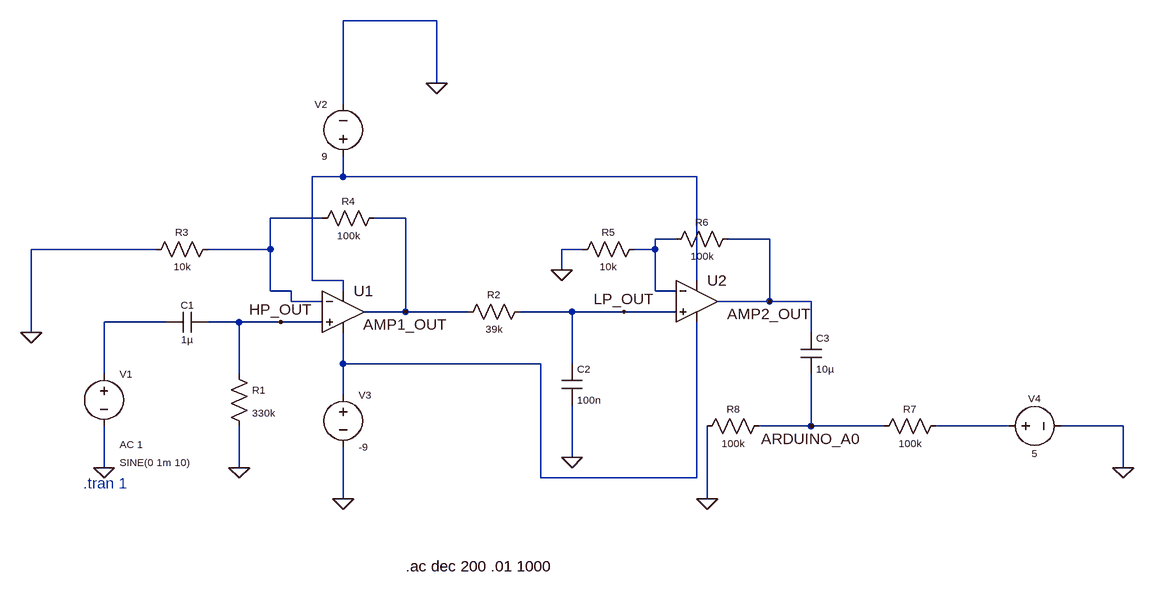
[diagram p0: schematic eeg_frontend_v1_ac_analysis.asc]
eeg_frontend_v1_ac_analysis.asc, the LTspice schematic file:
Version 4.1
SHEET 1 880 680
WIRE -3648 -512 -3792 -512
WIRE -3648 -416 -3648 -512
WIRE -3792 -384 -3792 -512
WIRE -3792 -272 -3792 -304
WIRE -3792 -272 -3840 -272
WIRE -3248 -272 -3792 -272
WIRE -3824 -208 -3904 -208
WIRE -3696 -208 -3744 -208
WIRE -3280 -176 -3312 -176
WIRE -3136 -176 -3200 -176
WIRE -4080 -160 -4272 -160
WIRE -3904 -160 -3904 -208
WIRE -3904 -160 -4000 -160
WIRE -3424 -160 -3456 -160
WIRE -3312 -160 -3312 -176
WIRE -3312 -160 -3344 -160
WIRE -3456 -128 -3456 -160
WIRE -3840 -112 -3840 -272
WIRE -3792 -112 -3840 -112
WIRE -3248 -112 -3248 -272
WIRE -3904 -96 -3904 -160
WIRE -3872 -96 -3904 -96
WIRE -3792 -96 -3792 -112
WIRE -3312 -96 -3312 -160
WIRE -3280 -96 -3312 -96
WIRE -3872 -80 -3872 -96
WIRE -3824 -80 -3872 -80
WIRE -3136 -80 -3136 -176
WIRE -3136 -80 -3216 -80
WIRE -3072 -80 -3136 -80
WIRE -3696 -64 -3696 -208
WIRE -3696 -64 -3760 -64
WIRE -3600 -64 -3696 -64
WIRE -3440 -64 -3520 -64
WIRE -3360 -64 -3440 -64
WIRE -3280 -64 -3360 -64
WIRE -4064 -48 -4160 -48
WIRE -3952 -48 -4000 -48
WIRE -3888 -48 -3952 -48
WIRE -3824 -48 -3888 -48
WIRE -4272 -32 -4272 -160
WIRE -3072 -32 -3072 -80
WIRE -3792 16 -3792 -32
WIRE -3488 16 -3792 16
WIRE -3440 16 -3440 -64
WIRE -4160 32 -4160 -48
WIRE -3952 32 -3952 -48
WIRE -3792 64 -3792 16
WIRE -3072 112 -3072 32
WIRE -3072 112 -3152 112
WIRE -2960 112 -3072 112
WIRE -2768 112 -2880 112
WIRE -2592 112 -2688 112
WIRE -3440 160 -3440 80
WIRE -4160 176 -4160 112
WIRE -3952 176 -3952 112
WIRE -2592 176 -2592 112
WIRE -3488 192 -3488 16
WIRE -3248 192 -3248 -48
WIRE -3248 192 -3488 192
WIRE -3792 224 -3792 144
WIRE -3232 224 -3232 112
FLAG -3952 176 0
FLAG -4160 176 0
FLAG -3440 160 0
FLAG -3648 -416 0
FLAG -3792 224 0
FLAG -3456 -128 0
FLAG -3232 224 0
FLAG -2592 176 0
FLAG -4272 -32 0
FLAG -3072 112 ARDUINO_A0
FLAG -3136 -80 AMP2_OUT
FLAG -3360 -64 LP_OUT
FLAG -3696 -64 AMP1_OUT
FLAG -3888 -48 HP_OUT
SYMBOL cap -4000 -64 R90
WINDOW 0 0 32 VBottom 1
WINDOW 3 32 32 VTop 1
SYMATTR InstName C1
SYMATTR Value 1µ
SYMBOL res -3968 16 R0
WINDOW 0 36 40 Left 1
WINDOW 3 36 76 Left 1
SYMATTR InstName R1
SYMATTR Value 330k
SYMBOL voltage -4160 16 R0
WINDOW 3 24 152 Left 1
WINDOW 123 24 124 Left 1
WINDOW 39 0 0 Left 0
WINDOW 0 24 16 Left 1
SYMATTR Value SINE(0 1m 10)
SYMATTR Value2 AC 1
SYMATTR InstName V1
SYMBOL res -3504 -80 R90
WINDOW 0 0 56 VBottom 1
WINDOW 3 32 56 VTop 1
SYMATTR InstName R2
SYMATTR Value 39k
SYMBOL cap -3456 16 R0
WINDOW 0 24 8 Left 1
WINDOW 3 24 56 Left 1
SYMATTR InstName C2
SYMATTR Value 100n
SYMBOL OpAmps\\UniversalOpAmp2 -3792 -64 R0
SYMATTR InstName U1
SYMBOL voltage -3792 -288 R180
WINDOW 0 24 96 Left 1
WINDOW 3 24 16 Left 1
WINDOW 123 0 0 Left 0
WINDOW 39 0 0 Left 0
SYMATTR InstName V2
SYMATTR Value 9
SYMBOL voltage -3792 48 R0
WINDOW 123 0 0 Left 0
WINDOW 39 0 0 Left 0
WINDOW 0 24 16 Left 1
WINDOW 3 24 96 Left 1
SYMATTR InstName V3
SYMATTR Value -9
SYMBOL res -3984 -176 R90
WINDOW 0 0 56 VBottom 1
WINDOW 3 32 56 VTop 1
SYMATTR InstName R3
SYMATTR Value 10k
SYMBOL res -3728 -224 R90
WINDOW 0 0 56 VBottom 1
WINDOW 3 32 56 VTop 1
SYMATTR InstName R4
SYMATTR Value 100k
SYMBOL OpAmps\\UniversalOpAmp2 -3248 -80 R0
SYMATTR InstName U2
SYMBOL res -3328 -176 R90
WINDOW 0 0 56 VBottom 1
WINDOW 3 32 56 VTop 1
SYMATTR InstName R5
SYMATTR Value 10k
SYMBOL res -3184 -192 R90
WINDOW 0 0 56 VBottom 1
WINDOW 3 32 56 VTop 1
SYMATTR InstName R6
SYMATTR Value 100k
SYMBOL cap -3088 -32 R0
WINDOW 0 24 8 Left 1
WINDOW 3 24 56 Left 1
SYMATTR InstName C3
SYMATTR Value 10µ
SYMBOL res -2864 96 R90
WINDOW 0 0 56 VBottom 1
WINDOW 3 32 56 VTop 1
SYMATTR InstName R7
SYMATTR Value 100k
SYMBOL res -3136 96 R90
WINDOW 0 0 56 VBottom 1
WINDOW 3 32 56 VTop 1
SYMATTR InstName R8
SYMATTR Value 100k
SYMBOL voltage -2784 112 R270
WINDOW 0 32 56 VTop 1
WINDOW 3 -32 56 VBottom 1
WINDOW 123 0 0 Left 0
WINDOW 39 0 0 Left 0
SYMATTR InstName V4
SYMATTR Value 5
TEXT -4192 200 Left 2 ;.tran 1
TEXT -3696 328 Left 2 !.ac dec 200 .01 1000

The netlist it stands for:
* eeg_frontend_v1_ac_analysis.asc
C1 HP_OUT N004 1µ
R1 HP_OUT 0 330k
V1 N004 0 SINE(0 1m 10) AC 1
R2 LP_OUT AMP1_OUT 39k
C2 LP_OUT 0 100n
X§U1 HP_OUT N002 N001 N005 AMP1_OUT level2 Avol=1Meg GBW=10Meg Slew=10Meg Ilimit=25m Rail=0 Vos=0 En=0 Enk=0 In=0 Ink=0 Rin=500Meg  ; pins In+ In- V+ V- OUT
V2 N001 0 9
V3 N005 0 -9
R3 N002 0 10k
R4 AMP1_OUT N002 100k
X§U2 LP_OUT N003 N001 N005 AMP2_OUT level2 Avol=1Meg GBW=10Meg Slew=10Meg Ilimit=25m Rail=0 Vos=0 En=0 Enk=0 In=0 Ink=0 Rin=500Meg  ; pins In+ In- V+ V- OUT
R5 N003 0 10k
R6 AMP2_OUT N003 100k
C3 AMP2_OUT ARDUINO_A0 10µ
R7 N006 ARDUINO_A0 100k
R8 ARDUINO_A0 0 100k
V4 N006 0 5
* .tran 1
.ac dec 200 .01 1000
.lib UniversalOpAmp2.lib
.backanno
.end